# Altium schematic sheet N25Q128A13ESE40.SchDoc
size A4; DocumentNumber: 7; SheetNumber: 7; SheetTotal: 21; SheetName: Configuration Memory
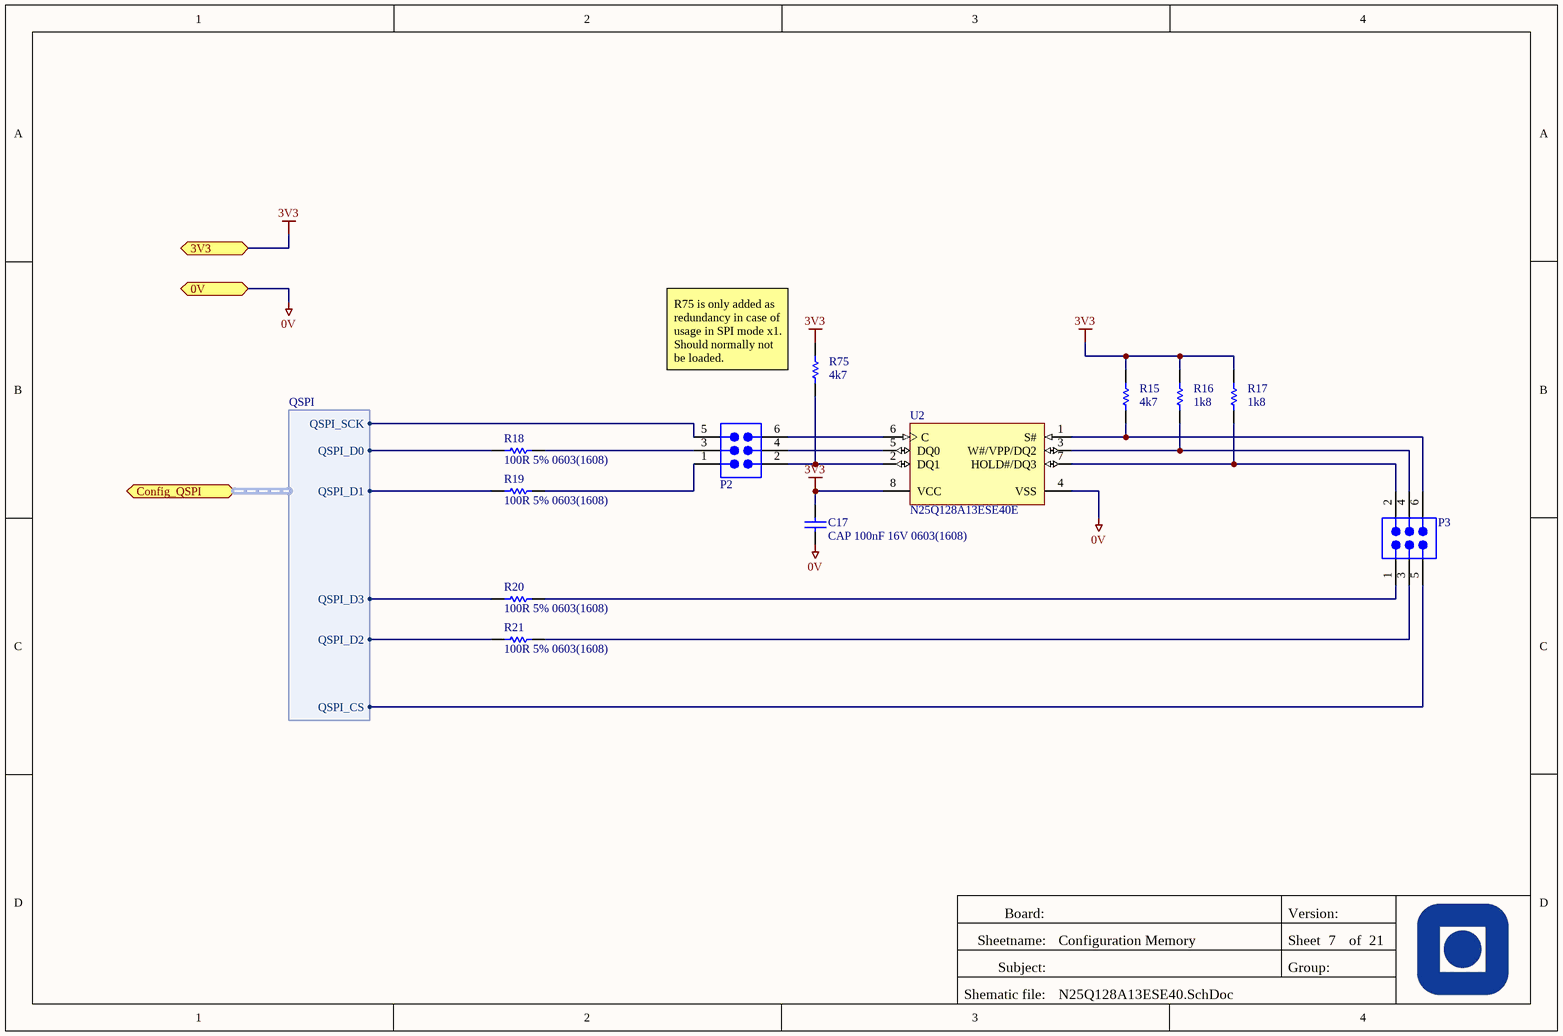
[diagram p0: N25Q128A13ESE40.SchDoc]

## Parts
C17  CAP 100nF 16V 0603(1608)  [CAPC0603(1608)100_M]
P2  TSW-103-08-T-D  [SMTC-TSW-103-08-X-D]  (value not drawn)
P3  TSW-103-08-T-D  [SMTC-TSW-103-08-X-D]  (value not drawn)
R15  value 4k7  [RESC0603(1608)_M]  (hidden comment: 4K7 5% 0603(1608))
R16  value 1k8  [RESC0603(1608)_M]  (hidden comment: 1K8 5% 0603(1608))
R17  value 1k8  [RESC0603(1608)_M]  (hidden comment: 1K8 5% 0603(1608))
R18  100R 5% 0603(1608)  [RESC0603(1608)_M]
R19  100R 5% 0603(1608)  [RESC0603(1608)_M]
R20  100R 5% 0603(1608)  [RESC0603(1608)_M]
R21  100R 5% 0603(1608)  [RESC0603(1608)_M]
R75  value 4k7  [RESC0603(1608)_M]  (hidden comment: 4K7 5% 0603(1608))
U2  N25Q128A13ESE40E  [MICT-SE-8_N]

## Ports
0V, 3V3, Config_QSPI (harness QSPI)

## Harnesses
QSPI: QSPI_D0, QSPI_D1, QSPI_D2, QSPI_D3, QSPI_SCK, QSPI_CS

## Nets
0V: C17.1 U2.4(VSS) ; port 0V
3V3: C17.2 R15.2 R16.2 R17.2 R75.2 U2.8(VCC) ; port 3V3
NetP2_1: P2.1 R19.1
NetP2_2: P2.2 R75.1 U2.2(DQ1)
NetP2_3: P2.3 R18.1
NetP2_4: P2.4 U2.5(DQ0)
NetP2_5: P2.5 ; port Config_QSPI.QSPI_SCK
NetP2_6: P2.6 U2.6(C)
NetP3_1: P3.1 R20.1
NetP3_2: P3.2 R17.1 U2.7(HOLD#/DQ3)
NetP3_3: P3.3 R21.1
NetP3_4: P3.4 R16.1 U2.3(W#/VPP/DQ2)
NetP3_5: P3.5 ; port Config_QSPI.QSPI_CS
NetP3_6: P3.6 R15.1 U2.1(S#)
NetR18_2: R18.2 ; port Config_QSPI.QSPI_D0
NetR19_2: R19.2 ; port Config_QSPI.QSPI_D1
NetR20_2: R20.2 ; port Config_QSPI.QSPI_D3
NetR21_2: R21.2 ; port Config_QSPI.QSPI_D2

## Notes on the sheet
- (near R75) R75 is only added as redundancy in case of usage in SPI mode x1. Should normally not be loaded.
- Board:
- Version:
- Sheetname:
- Subject:
- Group:
- Sheet
- of
- Shematic file:

## Library data of the parts
C17 = CMP-1035-02583-1: CAP 100nF 16V ±5% 0603 (1608 Metric) Thickness 1mm SMD; Tolerance: Â±5%; Case-Metric: 1608; Case-EIA: 0603; Rated Voltage: 16 V; Max Thickness: 1 mm; Technology: SMT; Value: 100nF
P2 P3 = CMP-1024-00335-1: 0.025" SQ Post Header, Through-hole, Vertical, -55 to 105 degC, 2.54 mm Pitch, 6-Pin, Male, RoHS; Manufacturer: Samtec; Pitch: 2.54 mm; PackageDescription: .025[0.64] SQ. Post Terminal Strip Assembly; DatasheetVersion: F-214; ComponentLink3Description: Package Specification; Mounting Technology: Through-hole; ComponentLink1URL: http://www.samtec.com; ComponentLink2URL: http://www.samtec.com/documents/webfiles/pdf/TSW_TH.PDF; PartNumber: TSW-103-08-T-D; ComponentLink1Description: Manufacturer URL; Temperature Range: -55 to 105 degC; ComponentLink2Description: Datasheet; PackageVersion: DM, 8/1988; RoHS: True; ComponentLink3URL: http://www.samtec.com/documents/webfiles/cpdf/TSW-XXX-XX-XXX-X-XX-XXX-MKT.pdf; Orientation: Vertical; PackageReference: TSW-103-08-X-D
R15 R75 = CMP-1012-00090-1: 4K7 0.1W 5% 0603 (1608 Metric)  SMD; Case-Metric: 1608; Case-EIA: 0603; Tolerance: 5 %; Technology: SMT; Power: 0.1 W
R16 R17 = CMP-1012-00080-1: 1K8 0.1W 5% 0603 (1608 Metric)  SMD; Case-Metric: 1608; Case-EIA: 0603; Tolerance: 5 %; Power: 0.1 W; Technology: SMT
R18-R21 = CMP-1012-00050-1: 100R 0.1W 5% 0603 (1608 Metric)  SMD; Case-EIA: 0603; Value: 100.00 Ohm; Case-Metric: 1608; Tolerance: 5 %; Technology: SMT; Power: 0.1 W
U2 = CMP-0357-00158-1: 128 Mb (x1/x2/x4) Serial NOR Flash Memory with Multi I/O, 108 MHz, 2.7 to 3.6 V, 8-pin SO8 Wide (SE), Tray; Part Family: N25QÂ; Manufacturer: Micron; Density: 128MbÂ; Speed: 108 MHzÂ; Voltage: 2.7V-3.6VÂ; ComponentLink1URL: http://www.micron.com/; Mounting Technology: Surface Mount; ComponentLink1Description: Manufacturer URL; DatasheetVersion: Rev. L; Type: Multi I/OÂ; ComponentLink3Description: Package Specification; Applications: EmbeddedÂ; ComponentLink3URL: http://www.micron.com/~/media/Documents/Products/Data%20Sheet/NOR%20Flash/Serial%20NOR/N25Q/n25q_32mb_1_8v_65nm.pdf; PackageDescription: 8-Pin SO Wide, 5.29 X 5.29 mm, Pitch 1.27 mm; RoHS: YesÂ; Width: x1/x2/x4Â; PartNumber: N25Q128A13ESE40E; PackageVersion: Rev. E; PackageReference: MICT-SE-8; ComponentLink2Description: Datasheet; Part Status: ProductionÂ; Package: SO8 WideÂ; ComponentLink2URL: http://www.micron.com/~/media/Documents/Products/Data%20Sheet/NOR%20Flash/Serial%20NOR/N25Q/n25q_128mb_3v_65nm.pdf